# EAGLE design Marklin BR 128 LED (EAGLE 9.6.2)
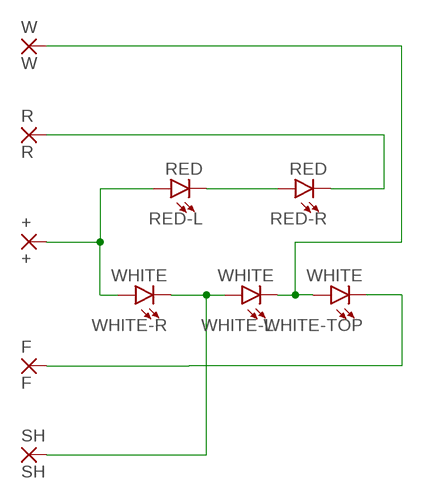
[diagram p0: schematic, sheet 1]

## Parts
+  +  SMD2  [SMD1,27-2,54]
F  F  SMD2  [SMD1,27-2,54]
R  R  SMD2  [SMD1,27-2,54]
RED-L  RED  LED-RED0603  [LED-0603]
RED-R  RED  LED-RED0603  [LED-0603]
SH  SH  SMD2  [SMD1,27-2,54]
W  W  SMD2  [SMD1,27-2,54]
WHITE-L  WHITE  LED-WHITE0603  [LED-0603]
WHITE-R  WHITE  LED-WHITE0603  [LED-0603]
WHITE-TOP  WHITE  LED-WHITE0603  [LED-0603]

## Nets
+: +.1(P) RED-L.A WHITE-R.A
F: F.1(P) WHITE-TOP.C
N$1: RED-L.C RED-R.A
N$32: W.1(P) WHITE-L.C WHITE-TOP.A
R: R.1(P) RED-R.C
SH: SH.1(P) WHITE-L.A WHITE-R.C

## Library data of the parts
+ F R SH W = wirepad:SMD2: SMD PAD
RED-L RED-R = SparkFun-LED:LED-RED: Red SMD LED Used in manufacturing of most products at SparkFun Packages: 0603 - SMD 0603 package [Product Link] <http://docs.avagotech.com/docs/AV02-0551EN> 0603 SMART - SMD 0603 SMART package ( more efficient and expensive)[Product Link] <http://www.osram-os.com/Graphics/XPic2/00077099_0.pdf> 1206 - SMD1206 package [Product Link] <https://www.sparkfun.com/datasheets/DevTools/LilyPad/Q150OVS4.pdff> SparkFun Products: Pro Mini 328 -5V <https://www.sparkfun.com/products/821> RedBoard <https://www.sparkfun.com/products/12757> IOIO-OTG <https://www.sparkfun.com/products/13613>; PROD_ID: DIO-00819
WHITE-L WHITE-R WHITE-TOP = SparkFun-LED:LED-WHITE: White SMD LED Used in manufacturing several products at SparkFun. Packages: 0603 - Bright White SMD 0603 package[Product Link] <http://www.kingbrightusa.com/product.asp?catalog_name=LED&product_id=APT1608QWF/D> 1206 - Bright White SMD1206 package [Product Link] <http://www.kingbrightusa.com/product.asp?catalog_name=LED&product_id=APT3216QWF/D> 3014 - Super Bright SMD 3014 package [Datasheet] <http://www.lumileds.com/uploads/459/DS208-pdf> SparkFun Products: Blackberry Trackballer Breakout <https://www.sparkfun.com/products/13169> Digital SandBox <https://www.sparkfun.com/products/12651>; PROD_ID: DIO-09004

## Board
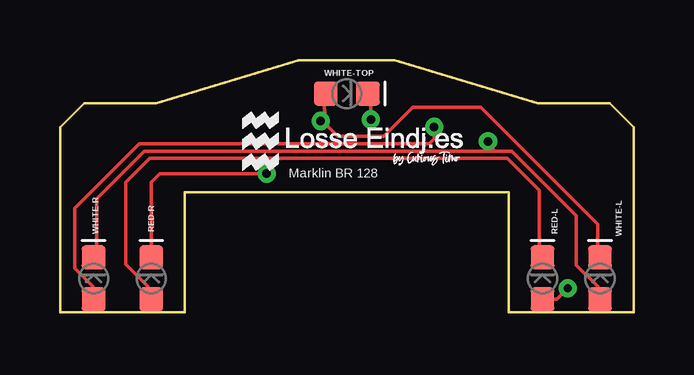
[diagram p1: board, top side]
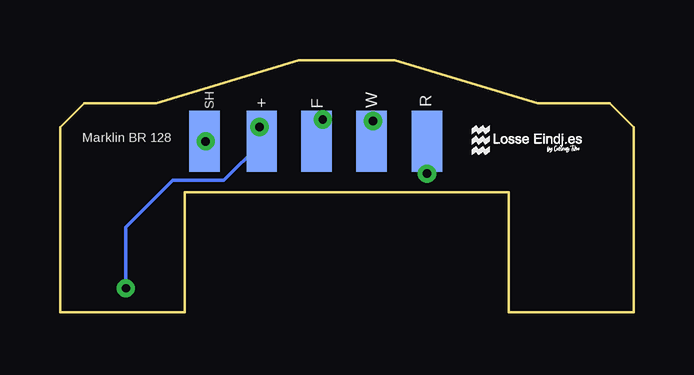
[diagram p2: board, bottom side, seen from below]

Size 23.9 x 10.5 mm. Coordinates in mm from the lower left corner, seen from the top.
Outline: 5.2,0 5.2,5 18.7,5 18.7,0 23.9,0 23.9,7.7 22.9,8.7 19.9,8.7 13.95,10.5 9.95,10.5 4,8.7 1,8.7 0,7.7 0,0 5.2,0
Copper layers (1*16): Top 0.035mm / dielectric 1.5mm / Bottom 0.035mm
Design rules "default *": minimum track width 6mil, minimum drill 0.35mm, track to track 6mil, track to pad 6mil, pad to pad 6mil, via to via 6mil, smd to smd 6mil, copper to edge 10mil, drill to drill 6mil, minimum pad ring 10mil, minimum via ring 8mil, stop-mask expansion 4mil, vias tented up to drill 0mil, thermal gap 10mil

### Footprints (pad centres in the part's own frame; a part is rotated, then mirrored left to right if it is on the bottom)
SMD1,27-2,54 = smd 1.27 x 2.54: 1 0,0
LED-0603 = smd 1 x 1: A -0.877,0; C 0.877,0

### Placement (x,y rotation side)
+  15.49,7.11 0 bottom
F  13.21,7.11 0 bottom
R  8.61,7.11 0 bottom
RED-L  20.1,1.4 90 top
RED-R  3.8,1.4 90 top
SH  17.88,7.11 0 bottom
W  10.92,7.11 0 bottom
WHITE-L  22.5,1.4 90 top
WHITE-R  1.4,1.4 90 top
WHITE-TOP  11.95,9.1 0 top

### Tracks (layer width: path | path; a pad name or v marks a point on that pad's centre or on a via)
+  (via drill 0.35)
  Top 0.152: v15.59,7.71 15.59,7.21 15.39,7.01 3.3,7.01 0.61,4.32 0.61,1.83 1.37,1.07 1.37,0.61 WHITE-R.A | RED-L.A 20.69,0.53 v21.16,0.99
  Bottom 0.152: v15.59,7.71 15.59,7.21 +.1 15.54,7.01 17.07,5.49 19.2,5.49 21.16,3.53 v21.16,0.99
F  (via drill 0.35)
  Top 0.152: WHITE-TOP.C 12.95,8.97 v12.95,8.02
  Bottom 0.152: v12.95,8.02 12.95,7.37 F.1
N$1
  Top 0.152: RED-R.A 3.66,0.61 3.66,1.07 2.74,1.98 2.74,5.41 3.73,6.4 18.64,6.4 19.96,5.08 19.96,2.29 RED-L.C
N$32  (via drill 0.35)
  Top 0.152: WHITE-TOP.A 11.07,9.06 10.99,8.98 11.04,8.27 10.86,8.09 v10.86,7.96 10.97,7.92 11.58,7.32 13.49,7.32 14.71,8.53 17.53,8.53 22.4,3.66 22.4,2.29 WHITE-L.C
  Bottom 0.152: v10.86,7.96 10.82,7.96 10.82,7.16 W.1
R  (via drill 0.35)
  Top 0.152: v8.61,5.77 4.17,5.77 3.81,5.41 RED-R.C
  Bottom 0.152: 8.66,7.01 R.1 v8.61,5.77
SH  (via drill 0.35)
  Top 0.152: 18.14,6.71 17.78,7.06 v17.83,7.11 | 18.14,6.71 3.5,6.71 1.52,4.72 1.52,2.29 WHITE-R.C | 18.14,6.71 18.82,6.71 21.51,4.01 21.51,1.96 22.4,1.07 22.4,0.61 WHITE-L.A
  Bottom 0.152: 17.78,7.01 SH.1 | 17.93,7.01 SH.1 | v17.83,7.11 SH.1

### Text on the board
tNames: Marklin BR 128 | /Users/timo/Downloads/Losse Eindjes Huisstijl/Losse Eindjes.bmp | /Users/timo/Downloads/Losse Eindjes Huisstijl/Losse Eindjes.bmp
bNames: Marklin BR 128